# EAGLE design LittleBitsToPlug (EAGLE 7.4.0)
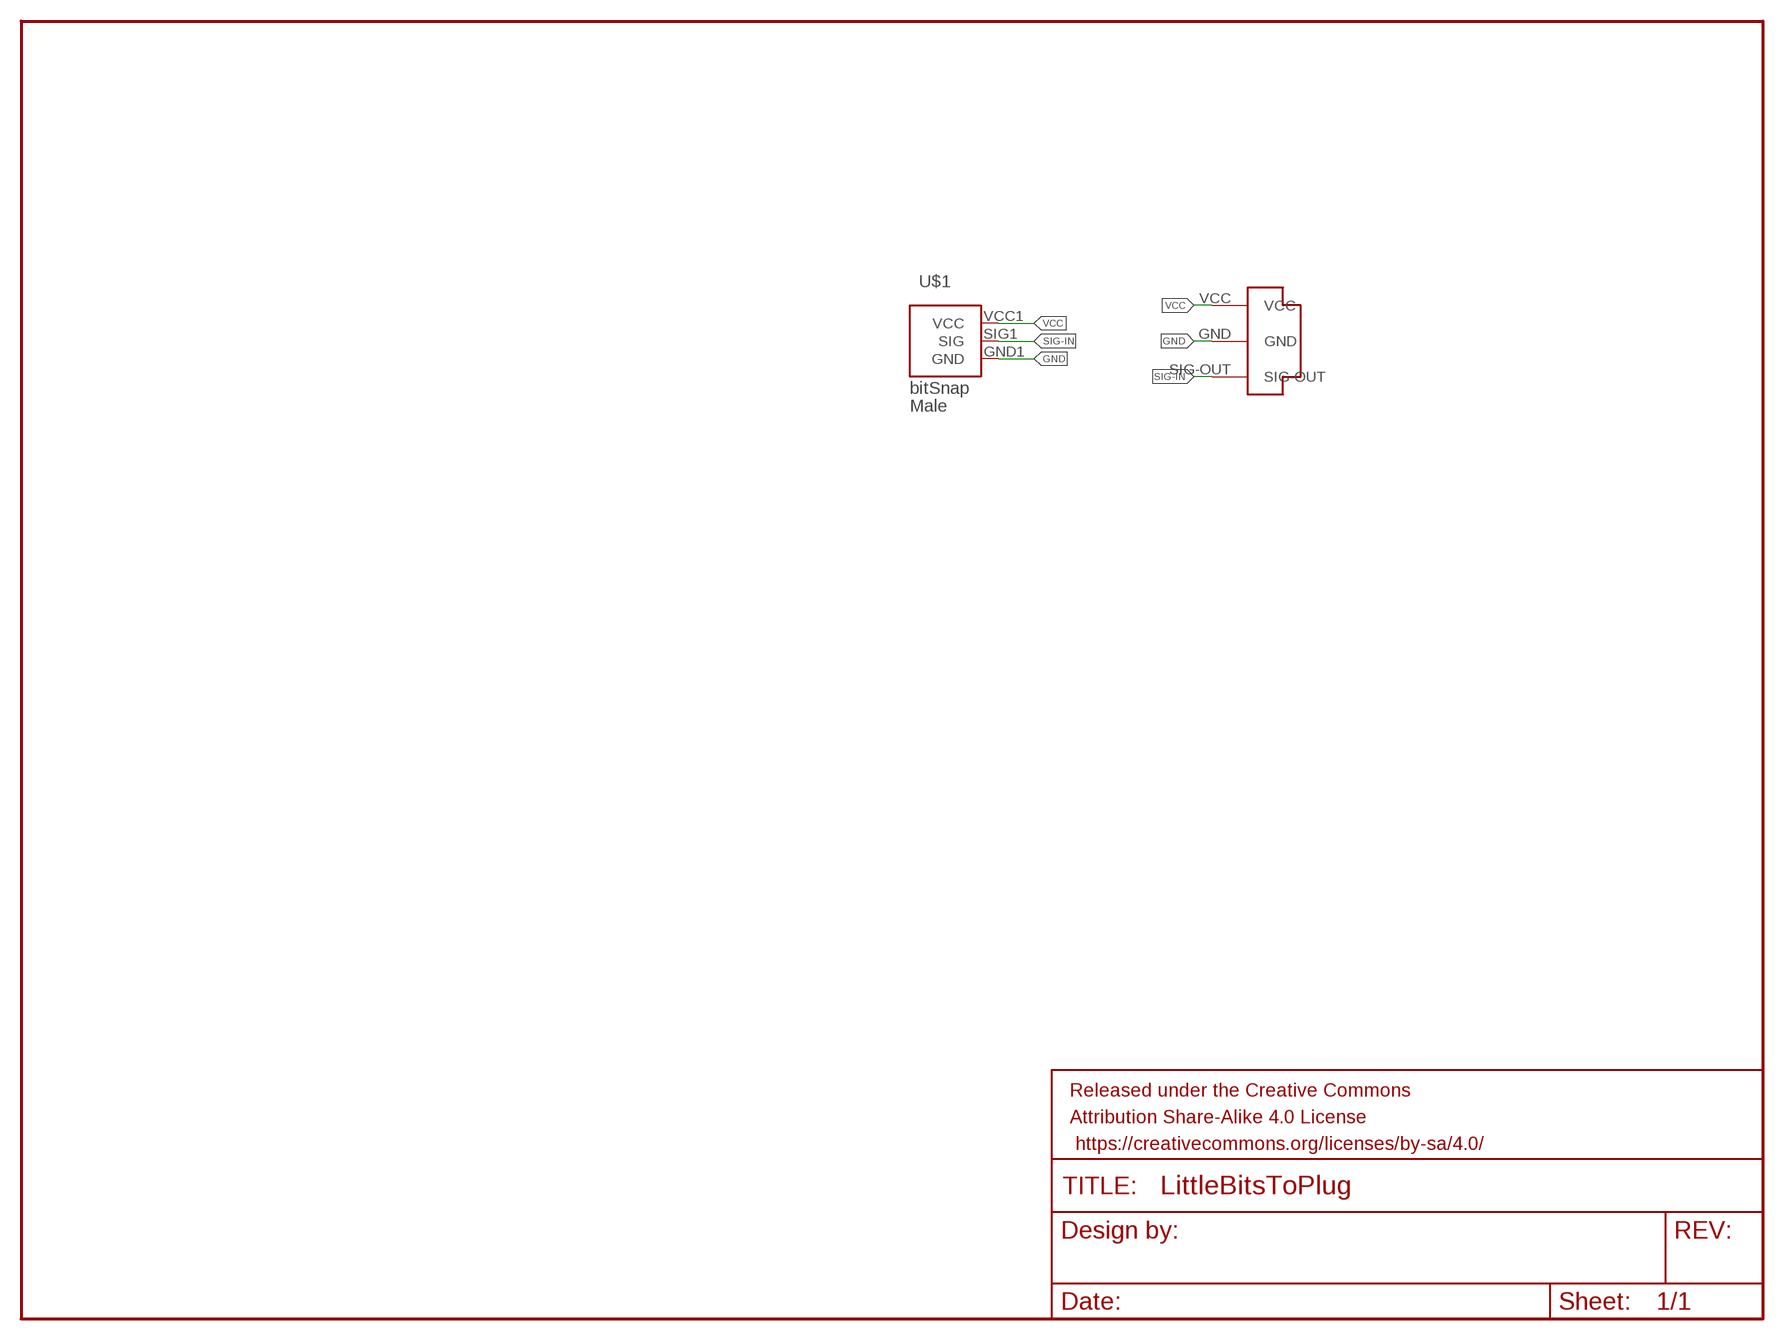
[diagram p0: schematic, sheet 1]

## Parts
FRAME1  FRAME-LETTERNO_PACKAGE  [DUMMY]
U$1  BITSNAP_V03_MALE  [BITSNAP_V03_MALE]
U$2  CONN-PLUG-3POS-3MM  [PLUG-3POS-3MM-SMD]

## Nets
GND: U$1.GND1(GND) U$2.GND
SIG-IN: U$1.SIG1(SIG) U$2.SIG-OUT
VCC: U$1.VCC1(VCC) U$2.VCC

## Library data of the parts
FRAME1 = SparkFun-Aesthetics:FRAME-LETTER: Schematic Frame Standard 8.5x11 US Letter frame; DESIGNER: Nobody; VERSION: v01
U$1 = bitSnap140813:BITSNAP_V03_MALE
U$2 = EmbeddedPlayground:CONN-PLUG-3POS-3MM: Surface mount board to board connector. Female socket, 3 position.

## Board
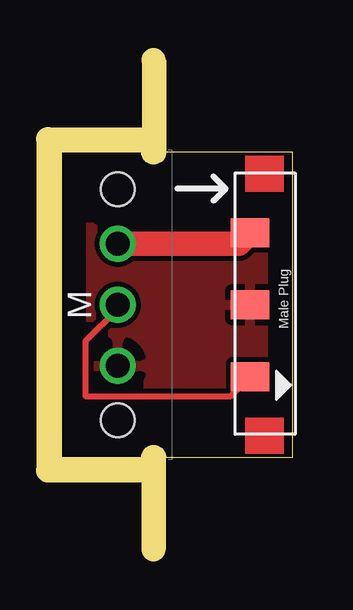
[diagram p1: board, top side]
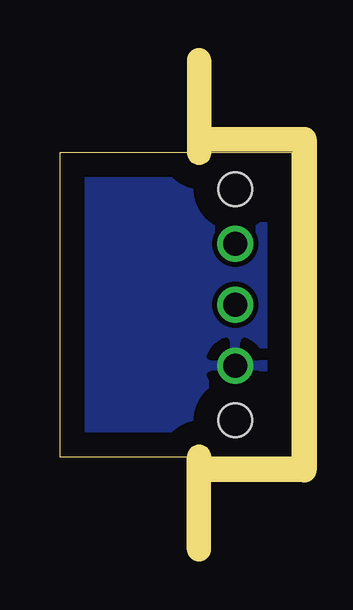
[diagram p2: board, bottom side, seen from below]

Size 9.65 x 12.7 mm. Coordinates in mm from the lower left corner, seen from the top.
Outline: 0,0 9.65,0 9.65,12.7 0,12.7 0,0
Copper layers (1*16): Top 0.035mm / dielectric 1.5mm / Bottom 0.035mm
Design rules "default": minimum track width 10mil, minimum drill 24mil, track to track 8mil, track to pad 8mil, pad to pad 8mil, via to via 8mil, smd to smd 8mil, copper to edge 40mil, drill to drill 8mil, minimum pad ring 10mil, minimum via ring 8mil, stop-mask expansion 4mil, vias tented up to drill 0mil, thermal gap 10mil

### Footprints (pad centres in the part's own frame; a part is rotated, then mirrored left to right if it is on the bottom)
BITSNAP_V03_MALE = drill 1: GND1 9.145,2.61; SIG1 6.605,2.61; VCC1 4.065,2.61 | hole 1.4: 1.785,2.61; 11.425,2.61
PLUG-3POS-3MM-SMD = smd 1.2 x 1.6: GND 0,0; SIG-OUT 3,0; VCC -3,0

### Placement (x,y rotation side)
FRAME1  1.02,8.13 0 top
U$1  -0.25,12.95 270 top
U$2  7.87,6.35 270 top

### Tracks (layer width: path | path; a pad name or v marks a point on that pad's centre or on a via)
GND
  pour Top: -1.78,12.95 -1.78,0.25 24.64,0.25 24.64,12.95
  pour Bottom: -1.78,12.95 24.64,12.95 24.64,0.25 -1.78,0.25
SIG-IN
  Top 0.254: U$1.SIG1 2.36,6.17 1.02,4.83 1.02,2.54 7.06,2.54 U$2.SIG-OUT
VCC
  Top 1.016: U$1.VCC1 7.41,8.89 U$2.VCC